# EAGLE design SSTuino_Evo (EAGLE 9.6.2)

## Sheet 1 of 2
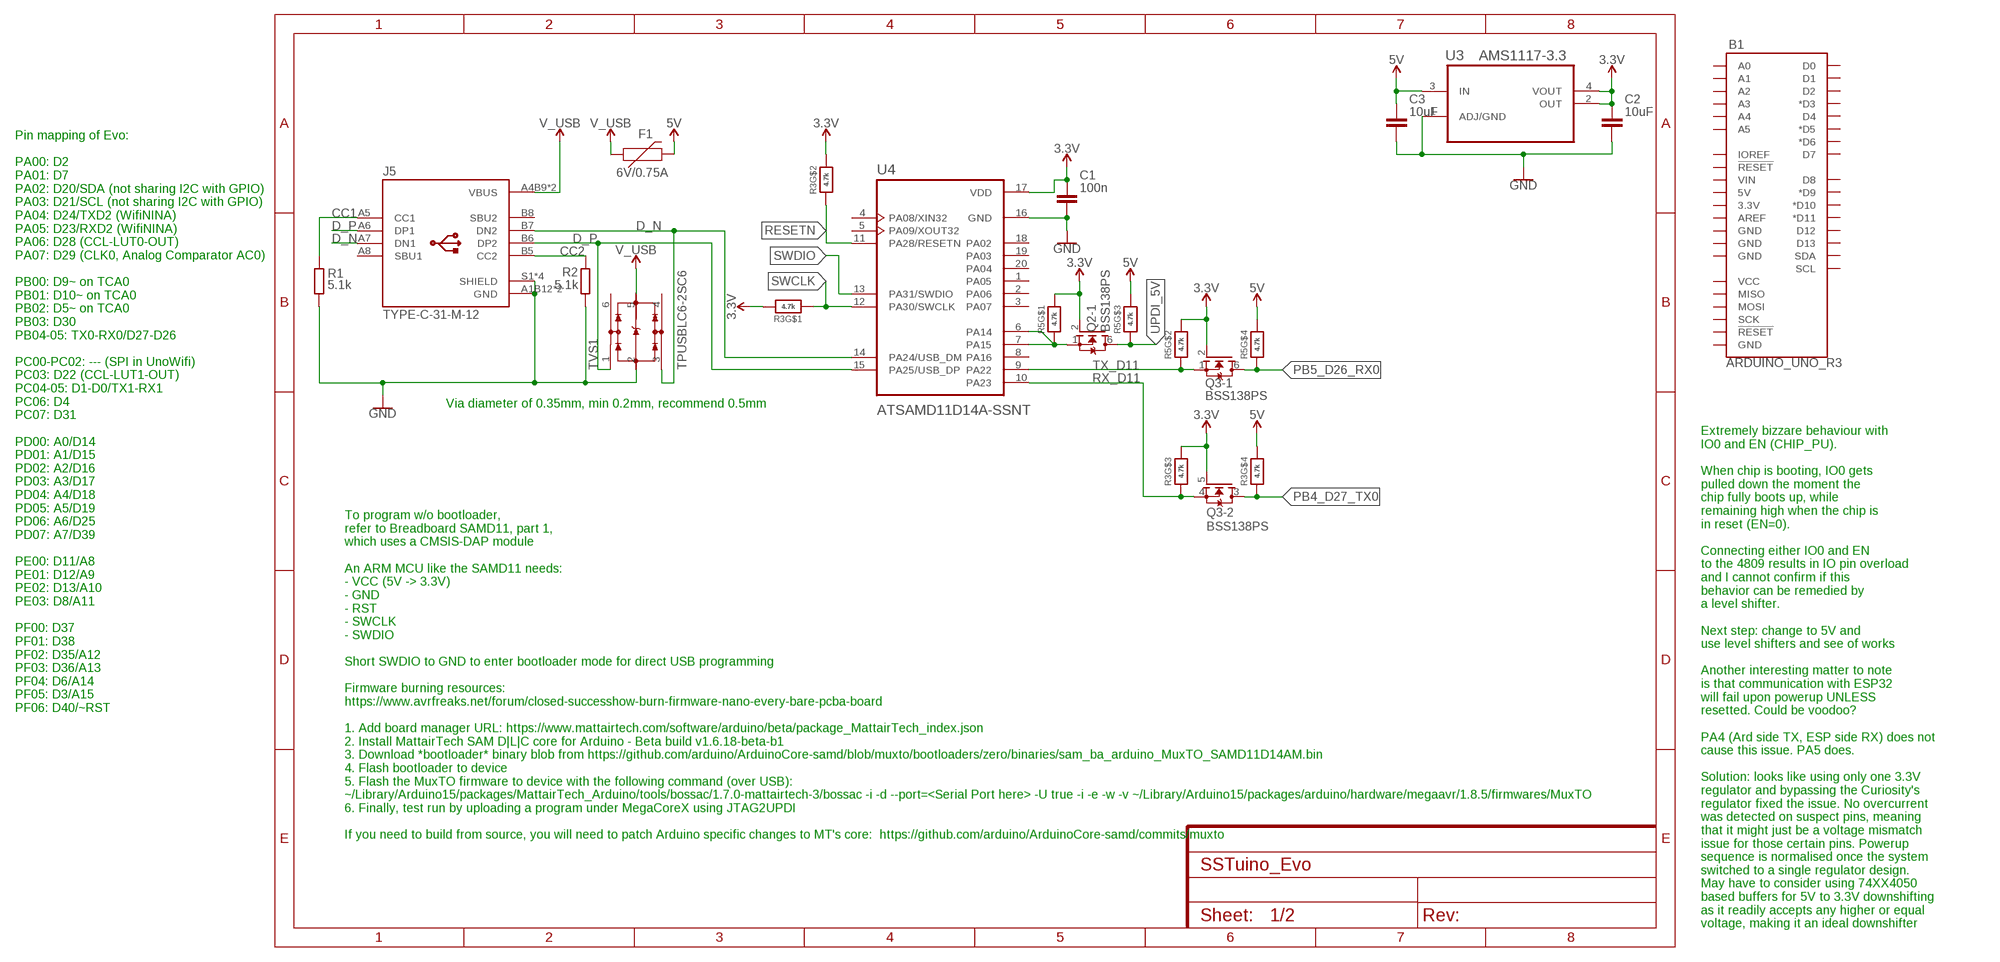
[diagram p0: schematic, sheet 1]

### Parts
B1  ARDUINO_UNO_R3  [ARDUINO_R3]
C1  100n  C_CHIP-0402(1005-METRIC)  [CAPC1005X60]
C2  10uF  C_CHIP-0603(1608-METRIC)  [CAPC1608X85]
C3  10uF  C_CHIP-0603(1608-METRIC)  [CAPC1608X85]
F1  6V/0.75A  PPTC_THREE-QUARTER-AMP  [1206]
J5  TYPE-C-31-M-12  [HRO_TYPE-C-31-M-12]
Q2  BSS138PS  [ARDUINO-TRANSISTORS_SOT363]
Q3  BSS138PS  [ARDUINO-TRANSISTORS_SOT363]
R1  5.1k  R_CHIP-0402(1005-METRIC)  [RESC1005X40]
R2  5.1k  R_CHIP-0402(1005-METRIC)  [RESC1005X40]
R3  4.7k  RESISTOR_4PACK0402  [RESPACK_4X0402]
R5  4.7k  RESISTOR_4PACK0402  [RESPACK_4X0402]
TVS1  TPUSBLC6-2SC6  [SOT95P280X110-6N]
U3  AMS1117-3.3  LM1117MP-3.3  [SOT230P696X180-4N]
U4  ATSAMD11D14A-SSNT  [SOIC127P1030X265-20N]

### Nets
3.3V: C1.1 C2.1 Q2.2(-1:G) Q3.2(-1:G) Q3.5(-2:G) R3.6 R3.7 R3.8 R5.7 R5.8 U3.2(OUT) U3.4(VOUT) U4.17(VDD) ; also sheet 2
5V: C3.1 F1.2 R3.5 R5.5 R5.6 U3.3(IN) ; also sheet 2
CC1: J5.A5(CC1) R1.1
CC2: J5.B5(CC2) R2.2
D_N [differential]: J5.A7(DN1) J5.B7(DN2) TVS1.3(IO2) U4.14(PA24/USB_DM)
D_P [differential]: J5.A6(DP1) J5.B6(DP2) TVS1.1(IO1) U4.15(PA25/USB_DP)
GND: C1.2 C2.2 C3.2 J5.A1B12(GND) J5.B1A12(GND) J5.S1(SHIELD) J5.S2(SHIELD) J5.S3(SHIELD) J5.S4(SHIELD) R1.2 R2.1 TVS1.2(VSS) U3.1(ADJ/GND) U4.16(GND) ; also sheet 2
PB4_D27_TX0: Q3.3(-2:D) R3.4 ; also sheet 2
PB5_D26_RX0: Q3.6(-1:D) R5.4 ; also sheet 2
RESETN: R3.2 U4.11(PA28/RESETN) ; also sheet 2
RX_D11: Q3.4(-2:S) R3.3 U4.10(PA23)
SWCLK: R3.1 U4.12(PA30/SWCLK) ; also sheet 2
SWDIO: U4.13(PA31/SWDIO) ; also sheet 2
TX_D11: Q3.1(-1:S) R5.2 U4.9(PA22)
UPDI_3V3: Q2.1(-1:S) R5.1 U4.6(PA14) U4.7(PA15)
UPDI_5V: Q2.6(-1:D) R5.3 ; also sheet 2
V_USB: F1.1 J5.A4B9(VBUS) J5.B4A9(VBUS) TVS1.5(VCC)
Unconnected: B1.3.3V B1.5V B1.A0 B1.A1 B1.A2 B1.A3 B1.A4 B1.A5 B1.AREF B1.D0 B1.D1 B1.D2 B1.D3(*D3) B1.D4 B1.D5(*D5) B1.D6(*D6) B1.D7 B1.D8 B1.D9(*D9) B1.D10(*D10) B1.D11(*D11) B1.D12 B1.D13 B1.GND@1(GND) B1.GND@2(GND) B1.GND@3(GND) B1.GND@4(GND) B1.IOREF B1.MISO B1.MOSI B1.RESET@1(!RESET!) B1.RESET@2(!RESET!) B1.SCK B1.SCL B1.SDA B1.VCC B1.VIN J5.A8(SBU1) J5.B8(SBU2) TVS1.4(IO3) TVS1.6(IO4) U4.1(PA05) U4.2(PA06) U4.3(PA07) U4.4(PA08/XIN32) U4.5(PA09/XOUT32) U4.8(PA16) U4.18(PA02) U4.19(PA03) U4.20(PA04)

### Notes on the sheet
- Via diameter of 0.35mm, min 0.2mm, recommend 0.5mm
- Pin mapping of Evo:
  
  PA00: D2
  PA01: D7
  PA02: D20/SDA (not sharing I2C with GPIO)
  PA03: D21/SCL (not sharing I2C with GPIO)
  PA04: D24/TXD2 (WifiNINA)
  PA05: D23/RXD2 (WifiNINA)
  PA06: D28 (CCL-LUT0-OUT)
  PA07: D29 (CLK0, Analog Comparator AC0)
  
  PB00: D9~ on TCA0
  PB01: D10~ on TCA0
  PB02: D5~ on TCA0
  PB03: D30
  PB04-05: TX0-RX0/D27-D26
  
  PC00-PC02: --- (SPI in UnoWifi)
  PC03: D22 (CCL-LUT1-OUT)
  PC04-05: D1-D0/TX1-RX1
  PC06: D4
  PC07: D31
  
  PD00: A0/D14
  PD01: A1/D15
  PD02: A2/D16
  PD03: A3/D17
  PD04: A4/D18
  PD05: A5/D19
  PD06: A6/D25
  PD07: A7/D39
  
  PE00: D11/A8
  PE01: D12/A9
  PE02: D13/A10
  PE03: D8/A11
  
  PF00: D37
  PF01: D38
  PF02: D35/A12
  PF03: D36/A13
  PF04: D6/A14
  PF05: D3/A15
  PF06: D40/~RST
- To program w/o bootloader,
  refer to Breadboard SAMD11, part 1,
  which uses a CMSIS-DAP module
  
  An ARM MCU like the SAMD11 needs:
  - VCC (5V -> 3.3V)
  - GND
  - RST
  - SWCLK
  - SWDIO
  
  Short SWDIO to GND to enter bootloader mode for direct USB programming
  
  Firmware burning resources:
  https://www.avrfreaks.net/forum/closed-successhow-burn-firmware-nano-every-bare-pcba-board
  
  1. Add board manager URL: https://www.mattairtech.com/software/arduino/beta/package_MattairTech_index.json
  2. Install MattairTech SAM D|L|C core for Arduino - Beta build v1.6.18-beta-b1
  3. Download *bootloader* binary blob from https://github.com/arduino/ArduinoCore-samd/blob/muxto/bootloaders/zero/binaries/sam_ba_arduino_MuxTO_SAMD11D14AM.bin
  4. Flash bootloader to device
  5. Flash the MuxTO firmware to device with the following command (over USB): 
  ~/Library/Arduino15/packages/MattairTech_Arduino/tools/bossac/1.7.0-mattairtech-3/bossac -i -d --port=<Serial Port here> -U true -i -e -w -v ~/Library/Arduino15/packages/arduino/hardware/megaavr/1.8.5/firmwares/MuxTO
  6. Finally, test run by uploading a program under MegaCoreX using JTAG2UPDI
  
  If you need to build from source, you will need to patch Arduino specific changes to MT's core:  https://github.com/arduino/ArduinoCore-samd/commits/muxto
- Extremely bizzare behaviour with
  IO0 and EN (CHIP_PU). 
  
  When chip is booting, IO0 gets 
  pulled down the moment the 
  chip fully boots up, while 
  remaining high when the chip is
  in reset (EN=0).
  
  Connecting either IO0 and EN
  to the 4809 results in IO pin overload
  and I cannot confirm if this
  behavior can be remedied by
  a level shifter. 
  
  Next step: change to 5V and
  use level shifters and see of works
  
  Another interesting matter to note
  is that communication with ESP32
  will fail upon powerup UNLESS
  resetted. Could be voodoo?
  
  PA4 (Ard side TX, ESP side RX) does not
  cause this issue. PA5 does.
  
  Solution: looks like using only one 3.3V 
  regulator and bypassing the Curiosity's
  regulator fixed the issue. No overcurrent
  was detected on suspect pins, meaning
  that it might just be a voltage mismatch
  issue for those certain pins. Powerup
  sequence is normalised once the system
  switched to a single regulator design.
  May have to consider using 74XX4050
  based buffers for 5V to 3.3V downshifting
  as it readily accepts any higher or equal
  voltage, making it an ideal downshifter

## Sheet 2 of 2
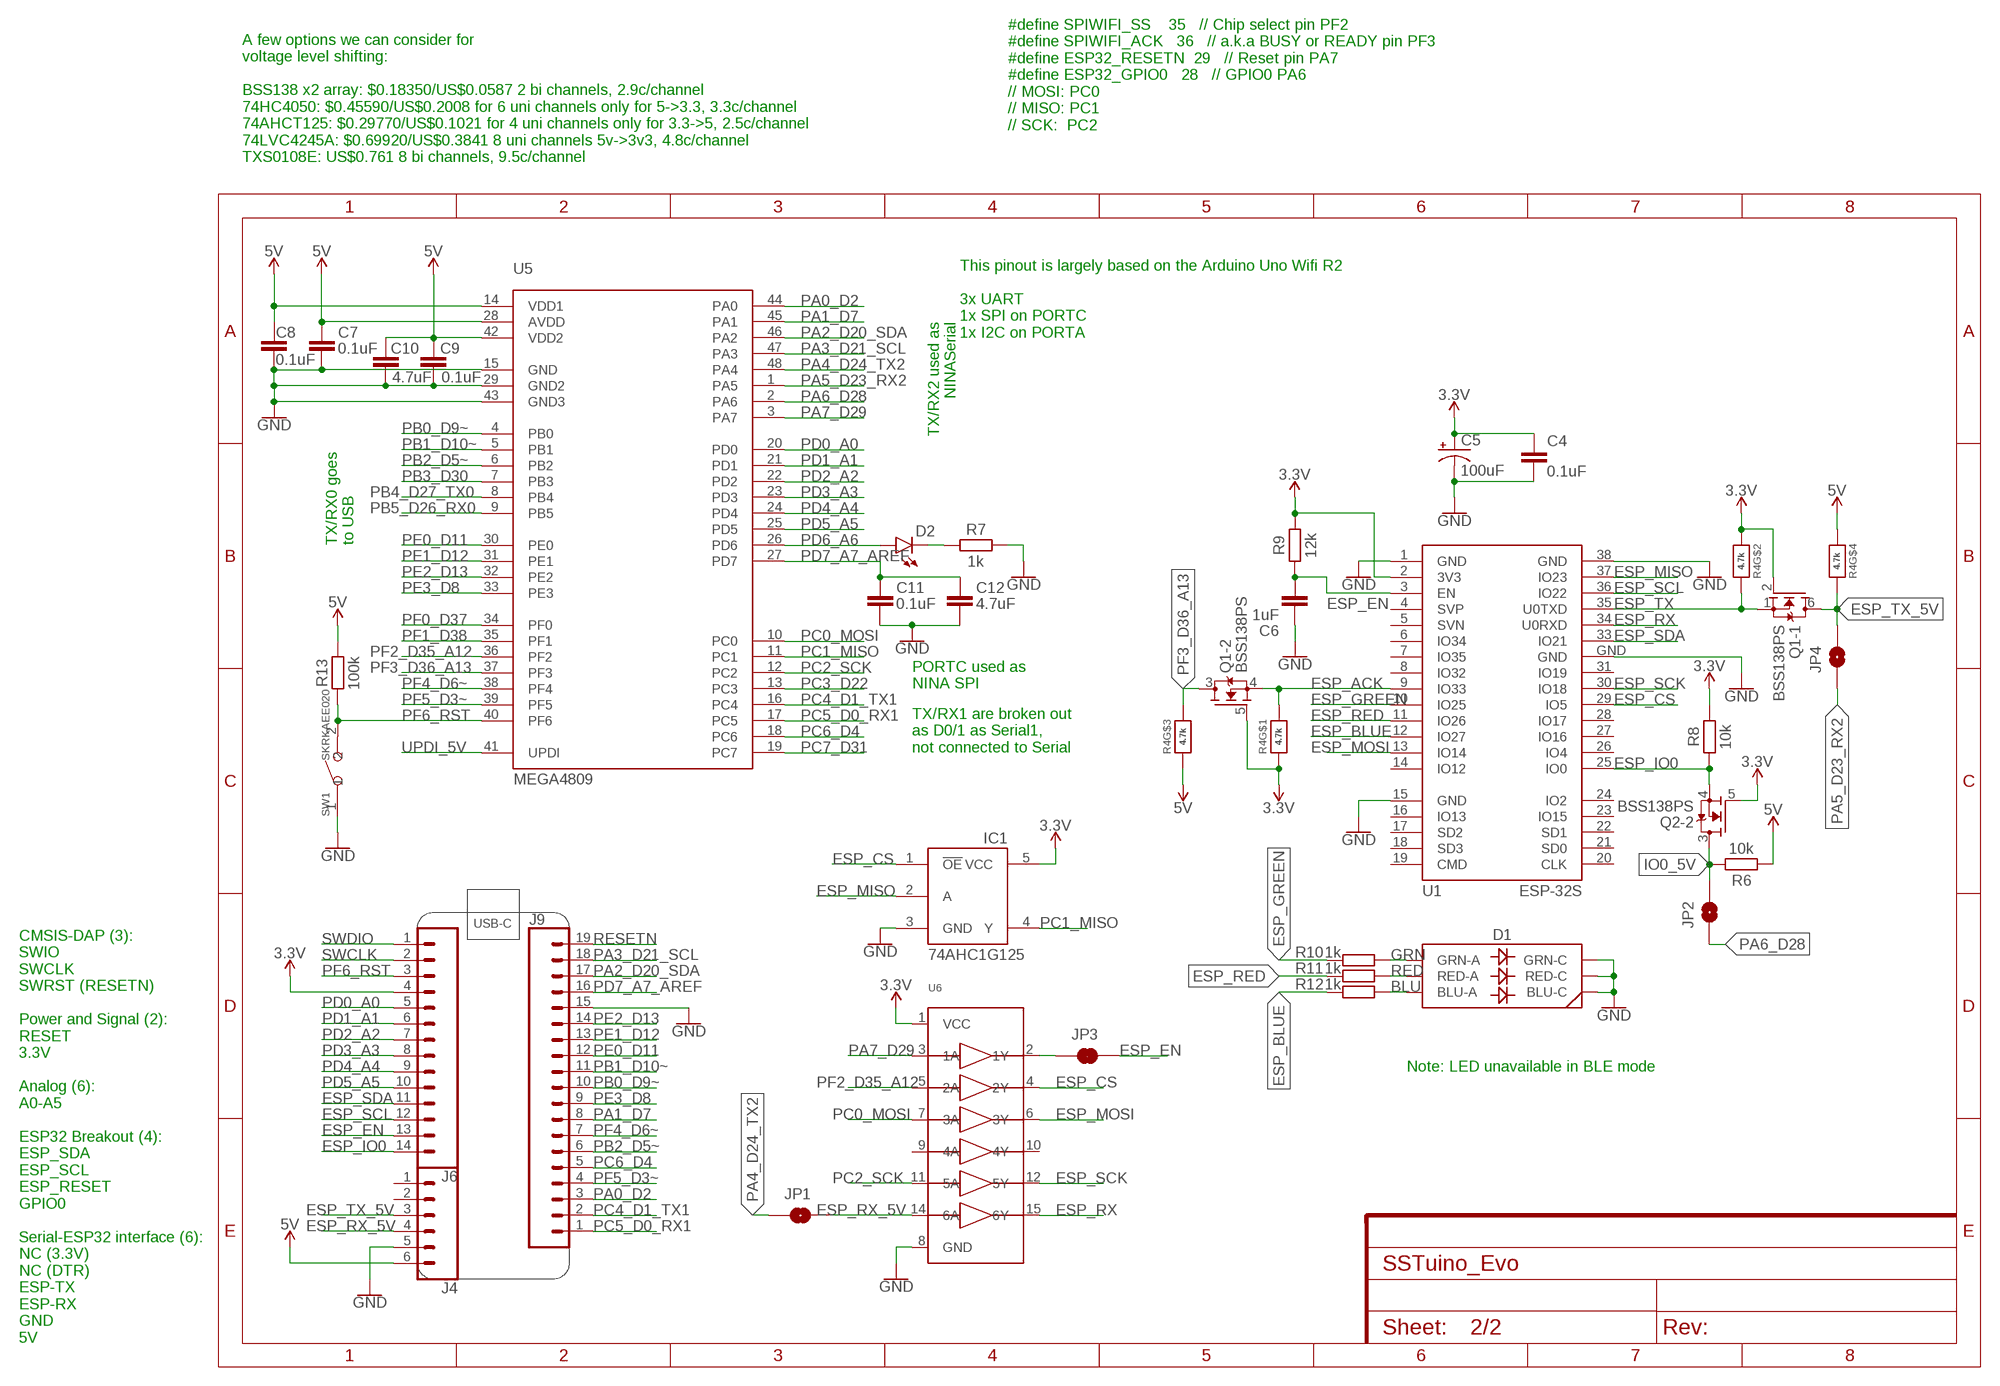
[diagram p1: schematic, sheet 2]

### Parts
C4  0.1uF  C_CHIP-0402(1005-METRIC)  [CAPC1005X60]
C5  100uF  C-POL-US_TANTALUM-1206(3216-METRIC)  [CAPMP3216X180N]
C6  1uF  C_CHIP-0402(1005-METRIC)  [CAPC1005X60]
C7  0.1uF  C_CHIP-0402(1005-METRIC)  [CAPC1005X60]
C8  0.1uF  C_CHIP-0402(1005-METRIC)  [CAPC1005X60]
C9  0.1uF  C_CHIP-0402(1005-METRIC)  [CAPC1005X60]
C10  4.7uF  C_CHIP-0402(1005-METRIC)  [CAPC1005X60]
C11  0.1uF  C_CHIP-0402(1005-METRIC)  [CAPC1005X60]
C12  4.7uF  C_CHIP-0402(1005-METRIC)  [CAPC1005X60]
D1  LED-RGBTC5050RGBF08  [LED-TRICOLOR-5050]
D2  LED0603  [LED-0603]
IC1  74AHC1G125  [SOT23-5L]
J4  CONN_06NO_SILK_FEMALE_PTH  [1X06_NO_SILK]
J6  CONN_14NO_SILK  [1X14_NO_SILK]
J9  CONN_191X19_NO_SILK  [1X19_NO_SILK]
JP1  JUMPER-SMT_2_NO_SILK  [SMT-JUMPER_2_NO_SILK]
JP2  JUMPER-SMT_2_NO_SILK  [SMT-JUMPER_2_NO_SILK]
JP3  JUMPER-SMT_2_NC_TRACE_SILK  [SMT-JUMPER_2_NC_TRACE_SILK]
JP4  JUMPER-SMT_2_NO_SILK  [SMT-JUMPER_2_NO_SILK]
Q1  BSS138PS  [ARDUINO-TRANSISTORS_SOT363]
R4  4.7k  RESISTOR_4PACK0402  [RESPACK_4X0402]
R6  10k  R_CHIP-0402(1005-METRIC)  [RESC1005X40]
R7  1k  R_CHIP-0402(1005-METRIC)  [RESC1005X40]
R8  10k  R_CHIP-0402(1005-METRIC)  [RESC1005X40]
R9  12k  R_CHIP-0402(1005-METRIC)  [RESC1005X40]
R10  1k  R_CHIP-0402(1005-METRIC)  [RESC1005X40]
R11  1k  R_CHIP-0402(1005-METRIC)  [RESC1005X40]
R12  1k  R_CHIP-0402(1005-METRIC)  [RESC1005X40]
R13  100k  R_CHIP-0402(1005-METRIC)  [RESC1005X40]
SW1  SKRKAEE020  SMD-BUTTON(2P-3.9X2.9X1.5+0.4MM)-SKRKAEE020  [SW2-2.6-3.9X2.9X1.5+0.4MM]
U1  ESP-32S  [ESP-32S]
U5  MEGA4809  [TQFP48]
U6  74HC4050DTSSOP  [TSSOP16]

### Nets
3.3V: C4.1 C5.1(+) IC1.5(VCC) J6.4 Q1.2(-1:G) Q1.5(-2:G) Q2.5(-2:G) R4.1 R4.2 R8.2 R9.2 U1.2(3V3) U6.1(VCC) ; also sheet 1
5V: C7.1 C8.1 C9.1 C10.1 J4.6 R4.3 R4.4 R6.1 R13.2 U5.14(VDD1) U5.28(AVDD) U5.42(VDD2) ; also sheet 1
BLU: D1.6(BLU-A) R12.2
ESP_ACK: Q1.4(-2:S) R4.8 U1.9(IO33)
ESP_BLUE: R12.1 U1.12(IO27)
ESP_CS: IC1.1(!OE) U1.29(IO5) U6.4(2Y)
ESP_EN: C6.2 J6.13 JP3.2 R9.1 U1.3(EN)
ESP_GREEN: R10.1 U1.10(IO25)
ESP_IO0: J6.14 Q2.4(-2:S) R8.1 U1.25(IO0)
ESP_MISO: IC1.2(A) U1.37(IO23)
ESP_MOSI: U1.13(IO14) U6.6(3Y)
ESP_RED: R11.1 U1.11(IO26)
ESP_RX: U1.34(U0RXD) U6.15(6Y)
ESP_RX_5V: J4.4 JP1.2 U6.14(6A)
ESP_SCK: U1.30(IO18) U6.12(5Y)
ESP_SCL: J6.12 U1.36(IO22)
ESP_SDA: J6.11 U1.33(IO21)
ESP_TX: Q1.1(-1:S) R4.7 U1.35(U0TXD)
ESP_TX_5V: J4.3 JP4.2 Q1.6(-1:D) R4.5
GND: C4.2 C5.2(-) C6.1 C7.2 C8.2 C9.2 C10.2 C11.2 C12.2 D1.1(BLU-C) D1.2(RED-C) D1.3(GRN-C) IC1.3(GND) J4.5 J9.15 R7.2 SW1.1 U1.1(GND) U1.15(GND) U1.38(GND) U1.GND U5.15(GND) U5.29(GND2) U5.43(GND3) U6.8(GND) ; also sheet 1
GRN: D1.4(GRN-A) R10.2
IO0_5V: JP2.2 Q2.3(-2:D) R6.2
N$2: D2.C R7.1
N$4: JP3.1 U6.2(1Y)
PA0_D2: J9.3 U5.44(PA0)
PA1_D7: J9.8 U5.45(PA1)
PA2_D20_SDA: J9.17 U5.46(PA2)
PA3_D21_SCL: J9.18 U5.47(PA3)
PA4_D24_TX2: JP1.1 U5.48(PA4)
PA5_D23_RX2: JP4.1 U5.1(PA5)
PA6_D28: JP2.1 U5.2(PA6)
PA7_D29: U5.3(PA7) U6.3(1A)
PB0_D9~: J9.10 U5.4(PB0)
PB1_D10~: J9.11 U5.5(PB1)
PB2_D5~: J9.6 U5.6(PB2)
PB3_D30: U5.7(PB3)
PB4_D27_TX0: U5.8(PB4) ; also sheet 1
PB5_D26_RX0: U5.9(PB5) ; also sheet 1
PC0_MOSI: U5.10(PC0) U6.7(3A)
PC1_MISO: IC1.4(Y) U5.11(PC1)
PC2_SCK: U5.12(PC2) U6.11(5A)
PC3_D22: U5.13(PC3)
PC4_D1_TX1: J9.2 U5.16(PC4)
PC5_D0_RX1: J9.1 U5.17(PC5)
PC6_D4: J9.5 U5.18(PC6)
PC7_D31: U5.19(PC7)
PD0_A0: J6.5 U5.20(PD0)
PD1_A1: J6.6 U5.21(PD1)
PD2_A2: J6.7 U5.22(PD2)
PD3_A3: J6.8 U5.23(PD3)
PD4_A4: J6.9 U5.24(PD4)
PD5_A5: J6.10 U5.25(PD5)
PD6_A6: D2.A U5.26(PD6)
PD7_A7_AREF: C11.1 C12.1 J9.16 U5.27(PD7)
PE0_D11: J9.12 U5.30(PE0)
PE1_D12: J9.13 U5.31(PE1)
PE2_D13: J9.14 U5.32(PE2)
PE3_D8: J9.9 U5.33(PE3)
PF0_D37: U5.34(PF0)
PF1_D38: U5.35(PF1)
PF2_D35_A12: U5.36(PF2) U6.5(2A)
PF3_D36_A13: Q1.3(-2:D) R4.6 U5.37(PF3)
PF4_D6~: J9.7 U5.38(PF4)
PF5_D3~: J9.4 U5.39(PF5)
PF6_RST: J6.3 R13.1 SW1.2 U5.40(PF6)
RED: D1.5(RED-A) R11.2
RESETN: J9.19 ; also sheet 1
SWCLK: J6.2 ; also sheet 1
SWDIO: J6.1 ; also sheet 1
UPDI_5V: U5.41(UPDI) ; also sheet 1
Unconnected: J4.1 J4.2 U1.4(SVP) U1.5(SVN) U1.6(IO34) U1.7(IO35) U1.8(IO32) U1.14(IO12) U1.16(IO13) U1.17(SD2) U1.18(SD3) U1.19(CMD) U1.20(CLK) U1.21(SD0) U1.22(SD1) U1.23(IO15) U1.24(IO2) U1.26(IO4) U1.27(IO16) U1.28(IO17) U1.31(IO19) U6.9(4A) U6.10(4Y)

### Notes on the sheet
- #define SPIWIFI_SS    35   // Chip select pin PF2
  #define SPIWIFI_ACK   36   // a.k.a BUSY or READY pin PF3
  #define ESP32_RESETN  29   // Reset pin PA7
  #define ESP32_GPIO0   28   // GPIO0 PA6
  // MOSI: PC0
  // MISO: PC1
  // SCK:  PC2
- A few options we can consider for
  voltage level shifting:
  
  BSS138 x2 array: $0.18350/US$0.0587 2 bi channels, 2.9c/channel
  74HC4050: $0.45590/US$0.2008 for 6 uni channels only for 5->3.3, 3.3c/channel
  74AHCT125: $0.29770/US$0.1021 for 4 uni channels only for 3.3->5, 2.5c/channel
  74LVC4245A: $0.69920/US$0.3841 8 uni channels 5v->3v3, 4.8c/channel
  TXS0108E: US$0.761 8 bi channels, 9.5c/channel
- TX/RX2 used as
  NINASerial
- This pinout is largely based on the Arduino Uno Wifi R2
  
  3x UART
  1x SPI on PORTC
  1x I2C on PORTA
- TX/RX0 goes
  to USB
- PORTC used as
  NINA SPI
- TX/RX1 are broken out 
  as D0/1 as Serial1,
  not connected to Serial
- USB-C
- Note: LED unavailable in BLE mode
- CMSIS-DAP (3):
  SWIO
  SWCLK
  SWRST (RESETN)
  
  Power and Signal (2):
  RESET
  3.3V
  
  Analog (6):
  A0-A5
  
  ESP32 Breakout (4):
  ESP_SDA
  ESP_SCL
  ESP_RESET
  GPIO0
  
  Serial-ESP32 interface (6):
  NC (3.3V)
  NC (DTR)
  ESP-TX
  ESP-RX
  GND
  5V

## Library data of the parts
B1 = SparkFun-Boards:ARDUINO_UNO_R3: Arduino R3 Footprint with SPI header Arduino Uno R3 Compatible Footprint. Matches PCB size of the original board. SparkFun Products: SAMD21 Dev Breakout <https://www.sparkfun.com/products/13672> RedBoard <https://www.sparkfun.com/products/12757> R3 Stackable Headers <https://www.sparkfun.com/products/11417>
C1-C4 C6-C12 = Capacitor:C: Capacitor - Generic; CATEGORY: Capacitor
C5 = Capacitor:C-POL-US: Capacitor Polarised - ANSI; CATEGORY: Capacitor
D1 = D3ltav's Custom:LED-RGB: LED-RGB 6 pin RGB LED (no common connector) Warning: please check and double check your pinout vs. the datasheet! 5050 SMD LEDs are commonly packaged in all sorts of weird, non-standard pinouts. This footprint and symbol is only applicable to the LED mentioned below Packages: LED-TRICOLOR-5050 - Based on TC5050RGBF08 RGB LED <https://datasheet.lcsc.com/szlcsc/2009231707_TCWIN-TC5050RGBF08-3CJH-AF53A_C784540.pdf>; PROD_ID: DIO-10298
D2 = SparkFun-LED:LED: LED (Generic) Standard schematic elements and footprints for 5mm, 3mm, 1206, and 0603 sized LEDs. Generic LEDs with no color specified.
F1 = SparkFun-Fuses:PPTC: Resettable Fuse PPTC Resettable Fuse. Really a sort of resistor with a polymeric positive temperature coefficient whose resistance increases dramatically with an increase in temperature. When heated by the power passing through the resistance rises causing the current to be limited, protecting the circuit. This is achieved by the transition of the polymer from a crystalline to an amorphous state where the conductive carbon separates breaking the conductive pathways found in the cool crystalline structure. When a PPTC cools back down it resumes conducting letting the circuit turn back on. SparkFun Products: SparkFun RedBoard - Programmed with Arduino <https://www.sparkfun.com/products/12757> Pro Micro - 5V/16MHz <https://www.sparkfun.com/products/12640> Arduino Pro 328 - 5V/16MHz <https://www.sparkfun.com/products/10915> MP3 Trigger <https://www.sparkfun.com/products/13720>; LCSC_PART: C99563; PROD_ID: RES-11150
IC1 = adafruit:74AHC1G125; LCSC_PART: C124295
J4 = SparkFun-Connectors:CONN_06: Multi connection point. Often used as Generic Header-pin footprint for 0.1 inch spaced/style header connections On any of the 0.1 inch spaced packages, you can populate with these: Break Away Headers - Straight <https://www.sparkfun.com/products/116> (PRT-00116) Break Away Male Headers - Right Angle <https://www.sparkfun.com/products/553> (PRT-00553) Female Headers <https://www.sparkfun.com/products/115> (PRT-00115) Break Away Headers - Machine Pin <https://www.sparkfun.com/products/117> (PRT-00117) Break Away Female Headers - Swiss Machine Pin <https://www.sparkfun.com/products/743> (PRT-00743) Arduino Stackable Header - 6 Pin <https://www.sparkfun.com/products/9280> (PRT-09280) For SCREWTERMINALS and SPRING TERMINALS visit here: Screw Terimnals on SparkFun.com <https://www.sparkfun.com/search/results?term=Screw+Terminals> (5mm/3.5mm/2.54mm spacing) This device is also useful as a general connection point to wire up your design to another part of your project. Our various solder wires solder well into these plated through hole pads. Hook-Up Wire - Assortment (Stranded, 22 AWG) <https://www.sparkfun.com/products/11375> (PRT-11375) Hook-Up Wire - Assortment (Solid Core, 22 AWG) <https://www.sparkfun.com/products/11367> (PRT-11367) View the entire wire category on our website here <https://www.sparkfun.com/categories/141>; PROD_ID: CONN-08437
J5 = D3ltav's Custom:TYPE-C-31-M-12: USB Connectors 24 Receptacle 1 8.94*7.3mm RoHS Check prices <https://pricing.snapeda.com/parts/TYPE-C-31-M-12/HRO%20Electronics%20Co.%2C%20Ltd./view-part?ref=eda>; AVAILABILITY: No availability data; DESCRIPTION: USB Connectors 24 Receptacle 1 8.94*7.3mm RoHS; LCSC_PART: C165948; MF: HRO Electronics Co., Ltd.; MP: TYPE-C-31-M-12; PACKAGE: Package; PRICE: None
J6 = SparkFun-Connectors:CONN_14: Multi connection point. Often used as Generic Header-pin footprint for 0.1 inch spaced/style header connections On any of the 0.1 inch spaced packages, you can populate with these: Break Away Headers - Straight <https://www.sparkfun.com/products/116> (PRT-00116) Break Away Male Headers - Right Angle <https://www.sparkfun.com/products/553> (PRT-00553) Female Headers <https://www.sparkfun.com/products/115> (PRT-00115) Break Away Headers - Machine Pin <https://www.sparkfun.com/products/117> (PRT-00117) Break Away Female Headers - Swiss Machine Pin <https://www.sparkfun.com/products/743> (PRT-00743) For SCREWTERMINALS and SPRING TERMINALS visit here: Screw Terimnals on SparkFun.com <https://www.sparkfun.com/search/results?term=Screw+Terminals> (5mm/3.5mm/2.54mm spacing) This device is also useful as a general connection point to wire up your design to another part of your project. Our various solder wires solder well into these plated through hole pads. Hook-Up Wire - Assortment (Stranded, 22 AWG) <https://www.sparkfun.com/products/11375> (PRT-11375) Hook-Up Wire - Assortment (Solid Core, 22 AWG) <https://www.sparkfun.com/products/11367> (PRT-11367) View the entire wire category on our website here <https://www.sparkfun.com/categories/141> Special notes: Molex polarized connector foot print use with SKU : PRT-08231 with associated crimp pins and housings. 1MM SMD Version SKU: PRT-10208 NOTES ON THE VARIANTS LOCK and LOCK_LONGPADS... This footprint was designed to help hold the alignment of a through-hole component (i.e. 6-pin header) while soldering it into place. You may notice that each hole has been shifted either up or down by 0.005 of an inch from it's more standard position (which is a perfectly straight line). This slight alteration caused the pins (the squares in the middle) to touch the edges of the holes. Because they are alternating, it causes a "brace" to hold the component in place. 0.005 has proven to be the perfect amount of "off-center" position when using our standard breakaway headers. Although looks a little odd when you look at the bare footprint, once you have a header in there, the alteration is very hard to notice. Also,if you push a header all the way into place, it is covered up entirely on the bottom side.
J9 = SparkFun-Connectors:CONN_19: Multi connection point. Often used as Generic Header-pin footprint for 0.1 inch spaced/style header connections On any of the 0.1 inch spaced packages, you can populate with these: Break Away Headers - Straight <https://www.sparkfun.com/products/116> (PRT-00116) Break Away Male Headers - Right Angle <https://www.sparkfun.com/products/553> (PRT-00553) Female Headers <https://www.sparkfun.com/products/115> (PRT-00115) Break Away Headers - Machine Pin <https://www.sparkfun.com/products/117> (PRT-00117) Break Away Female Headers - Swiss Machine Pin <https://www.sparkfun.com/products/743> (PRT-00743) For SCREWTERMINALS and SPRING TERMINALS visit here: Screw Terimnals on SparkFun.com <https://www.sparkfun.com/search/results?term=Screw+Terminals> (5mm/3.5mm/2.54mm spacing) This device is also useful as a general connection point to wire up your design to another part of your project. Our various solder wires solder well into these plated through hole pads. Hook-Up Wire - Assortment (Stranded, 22 AWG) <https://www.sparkfun.com/products/11375> (PRT-11375) Hook-Up Wire - Assortment (Solid Core, 22 AWG) <https://www.sparkfun.com/products/11367> (PRT-11367) View the entire wire category on our website here <https://www.sparkfun.com/categories/141> Special notes: Molex polarized connector foot print use with SKU : PRT-08231 with associated crimp pins and housings. 1MM SMD Version SKU: PRT-10208 NOTES ON THE VARIANTS LOCK and LOCK_LONGPADS... This footprint was designed to help hold the alignment of a through-hole component (i.e. 6-pin header) while soldering it into place. You may notice that each hole has been shifted either up or down by 0.005 of an inch from it's more standard position (which is a perfectly straight line). This slight alteration caused the pins (the squares in the middle) to touch the edges of the holes. Because they are alternating, it causes a "brace" to hold the component in place. 0.005 has proven to be the perfect amount of "off-center" position when using our standard breakaway headers. Although looks a little odd when you look at the bare footprint, once you have a header in there, the alteration is very hard to notice. Also,if you push a header all the way into place, it is covered up entirely on the bottom side.
JP1 JP2 JP4 = SparkFun-Jumpers:JUMPER-SMT_2_NO: Normally open jumper This jumper has two pads in close proximity to each other. Apply solder to close the connection. Round pads are easier to solder for beginners, but are a lot larger. SparkFun Product that uses the round pads: SparkFun EL Sequencer <https://www.sparkfun.com/products/12781>
JP3 = SparkFun-Jumpers:JUMPER-SMT_2_NC_TRACE: Normally closed trace jumper This jumper has a trace between two pads so it's normally closed (NC). Use a razor knife to open the connection. For best results follow the IPC guidelines for cutting traces: Cutout at least 0.063 mm (0.005 in). Remove all loose material to clean up the cut area. Seal the cut with an approved epoxy. Reapply solder to reclose the connection.
Q1-Q3 = D3ltav's Custom:BSS138PS: MOSFET 2N-CH 60V 0.32A 6TSSOP; CODE-ARDUINO: 2323; DATASHEET: https://assets.nexperia.com/documents/data-sheet/BSS138PS.pdf; DISTRIBUTOR-LINK: http://www.digikey.com/product-detail/en/nxp-semiconductors/BSS138PS,115/568-8393-1-ND/2763927; DISTRIBUTOR-PN: 568-8393-1-ND; LCSC_PART: C193381; MANUFACTURER: NXP; MANUFACTURER-PN: BSS138PS,115
R1 R2 R6-R13 = Resistor:R: Resistor Fixed - Generic; CATEGORY: Resistor; SUB-CATEGORY: Fixed
R3-R5 = D3ltav's Custom:RESISTOR_4PACK: Resistor Packs (4 resistors) 4 x 0603 10K 1/16W - Digikey: YC164J-10KCT-ND; LCSC_PART: C1980
SW1 = D3ltav's Custom:SMD-BUTTON(2P-3.9X2.9X1.5+0.4MM): 311020047; LCSC_PART: C115357; MPN: SKRKAEE020
TVS1 = D3ltav's Custom:TPUSBLC6-2SC6: TPUSBLC6-2SC6 Low Capacitance 2-Line ESD Protection www.sot23.com.tw; LCSC_PART: C558442
U1 = esp32:ESP-32S: Ai-Thinker ESP-32S
U3 = D3ltav's Custom:LM1117MP-3.3: Linear regulators; LCSC_PART: C6186; MPN: LM1117MP-3.3; OC_FARNELL: 9778195; OC_NEWARK: 41K3470; PACKAGE: SOT223-3; SUPPLIER: NationalSemiconductor
U4 = D3ltav's Custom:ATSAMD11D14A-SSNT; AVAILABILITY: In Stock; DESCRIPTION: ARM® Cortex®-M0+ SAM D11D Microcontroller IC 32-Bit 48MHz 16KB (16K x 8) FLASH 20-SOIC; LCSC_PART: C2053599; MF: Microchip; MP: ATSAMD11D14A-SSNT; PACKAGE: SOIC-20 Microchip; PRICE: None
U5 = microwavemont_ATMEGA4809:MEGA4809; LCSC_PART: C189475
U6 = D3ltav's Custom:74HC4050D: 6-channel level shifter 74HC4050D - 2V-6V Supply SOIC16 Digikey: 74HC4050D,653-ND Mouser: 771-74HC4050D-T TSSOP16 Digikey: 296-9215-1-ND Mouser:; LCSC_PART: C43181

## Net classes
0 default: width 0.203 mm, drill 0.35 mm
1 differential: width 0.254 mm

## Board
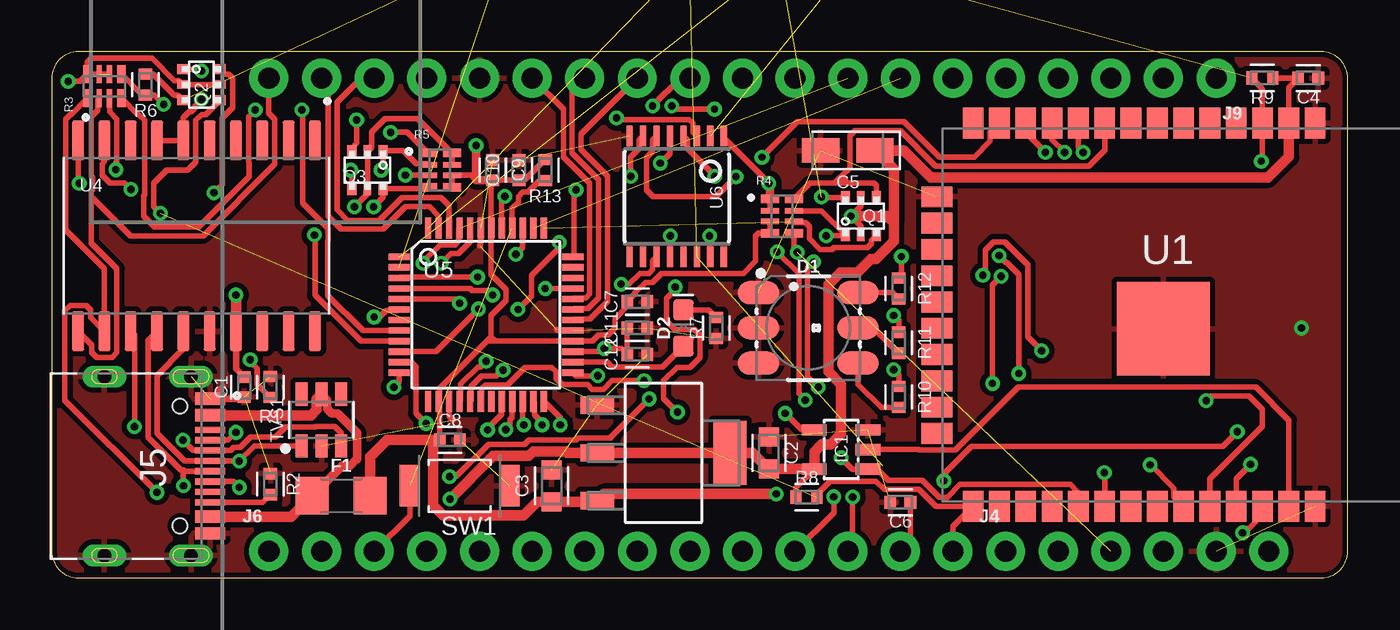
[diagram p2: board, top side]
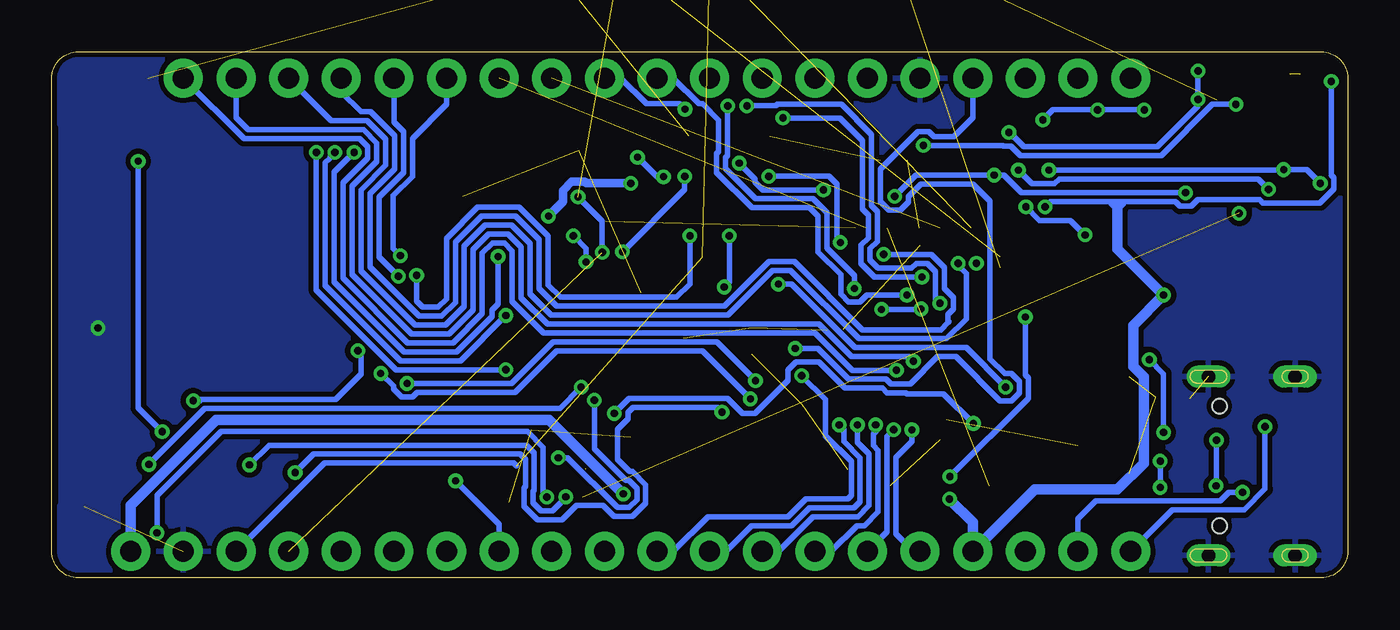
[diagram p3: board, bottom side, seen from below]

Size 62.55 x 25.4 mm. Coordinates in mm from the lower left corner, seen from the top.
Outline: 0,24.13 0,1.27 arc90 1.27,0 61.28,0 arc90 62.55,1.27 62.55,24.13 arc90 61.28,25.4 1.27,25.4 arc90 0,24.13
Copper layers (1*16): Top 0.035mm / dielectric 1.5mm / Bottom 0.035mm
Design rules "SparkFun-2-Layer-General-JLCPCB": minimum track width 7mil, minimum drill 0.3mm, track to track 7mil, track to pad 7mil, pad to pad 7mil, via to via 7mil, smd to smd 7mil, copper to edge 7mil, drill to drill 7mil, minimum pad ring 7mil, minimum via ring 7mil, stop-mask expansion 3mil, vias tented up to drill 25mil, thermal gap 10mil

### Footprints (pad centres in the part's own frame; a part is rotated, then mirrored left to right if it is on the bottom)
ARDUINO_R3 = drill 1.016 pad 1.93: 3.3V 2.54,-24.13; 5V 5.08,-24.13; A0 17.78,-24.13; A1 20.32,-24.13; A2 22.86,-24.13; A3 25.4,-24.13; A4 27.94,-24.13; A5 30.48,-24.13; AREF -9.144,24.13; D0 30.48,24.13; D1 27.94,24.13; D2 25.4,24.13; D3 22.86,24.13; D4 20.32,24.13; D5 17.78,24.13; D6 15.24,24.13; D7 12.7,24.13; D8 8.636,24.13; D9 6.096,24.13; D10 3.556,24.13; D11 1.016,24.13; D12 -1.524,24.13; D13 -4.064,24.13; GND@1 7.62,-24.13; GND@2 10.16,-24.13; GND@3 -6.604,24.13; GND@4 33.16,-1.32; IOREF -2.54,-24.13; MISO 30.62,3.76; MOSI 33.16,1.22; NC -5.08,-24.13; RESET@1 0,-24.13; RESET@2 30.62,-1.32; SCK 30.62,1.22; SCL -14.224,24.13; SDA -11.684,24.13; VCC 33.16,3.76; VIN 12.7,-24.13 | hole 3.175: -17.78,24.13; 33.02,8.89; 33.02,-19.05; -19.05,-24.13
CAPC1005X60 = smd 0.56 x 0.629: 1 -0.485,0; 2 0.485,0
CAPC1608X85 = smd 0.921 x 0.97: 1 -0.775,0; 2 0.775,0
CAPMP3216X180N = smd 1.796 x 1.189: 1 -1.31,0; 2 1.31,0
LED-TRICOLOR-5050 = smd 2 x 1.1: 1 2.4,-1.7; 2 2.4,0; 3 2.4,1.7; 4 -2.4,1.7; 5 -2.4,0; 6 -2.4,-1.7
LED-0603 = smd 1 x 1: A -0.877,0; C 0.877,0
1206 = smd 1.6 x 1.8: 1 -1.4,0; 2 1.4,0
SOT23-5L = smd 0.55 x 1.2: 1 -0.95,-1.3; 2 0,-1.3; 3 0.95,-1.3; 4 0.95,1.3; 5 -0.95,1.3
1X06_NO_SILK = drill 1.016 pad 1.88: 1 0,0; 2 2.54,0; 3 5.08,0; 4 7.62,0; 5 10.16,0; 6 12.7,0
HRO_TYPE-C-31-M-12 = smd 0.6 x 1.45: A1B12 -3.25,5.095; A4B9 -2.45,5.095; B1A12 3.25,5.095; B4A9 2.45,5.095 | smd 0.3 x 1.45: A5 -1.25,5.095; A6 -0.25,5.095; A7 0.25,5.095; A8 1.25,5.095; B5 1.75,5.095; B6 0.75,5.095; B7 -0.75,5.095; B8 -1.75,5.095 | drill 0.65 pad 1.05 long: S1 -4.32,4.18; S2 4.32,4.18; S3 -4.32,0; S4 4.32,0 | hole 0.7: -2.89,3.65; 2.89,3.65
1X14_NO_SILK = drill 1.016 pad 1.88: 1 0,0; 2 2.54,0; 3 5.08,0; 4 7.62,0; 5 10.16,0; 6 12.7,0; 7 15.24,0; 8 17.78,0; 9 20.32,0; 10 22.86,0; 11 25.4,0; 12 27.94,0; 13 30.48,0; 14 33.02,0
1X19_NO_SILK = drill 1.016 pad 1.88: 1 0,0; 2 2.54,0; 3 5.08,0; 4 7.62,0; 5 10.16,0; 6 12.7,0; 7 15.24,0; 8 17.78,0; 9 20.32,0; 10 22.86,0; 11 25.4,0; 12 27.94,0; 13 30.48,0; 14 33.02,0; 15 35.56,0; 16 38.1,0; 17 40.64,0; 18 43.18,0; 19 45.72,0
SMT-JUMPER_2_NO_SILK = smd 0.635 x 1.27: 1 -0.406,0; 2 0.406,0
SMT-JUMPER_2_NC_TRACE_SILK = smd 0.635 x 1.27: 1 -0.508,0; 2 0.508,0
ARDUINO-TRANSISTORS_SOT363 = smd 0.5 x 0.6: 1 -0.75,-0.9; 3 0.75,-0.9; 4 0.75,0.9; 6 -0.75,0.9 | smd 0.4 x 0.6: 2 0,-0.9; 5 0,0.9
RESC1005X40 = smd 0.535 x 0.644: 1 -0.507,0; 2 0.507,0
RESPACK_4X0402 = smd 0.87 x 0.41: 1 -0.58,0.825; 4 -0.58,-0.825; 5 0.58,-0.825; 8 0.58,0.825 | smd 0.87 x 0.26: 2 -0.58,0.25; 3 -0.58,-0.25; 6 0.58,-0.25; 7 0.58,0.25
SW2-2.6-3.9X2.9X1.5+0.4MM = smd 1 x 2: 1 -2.4,0; 2 2.4,0
SOT95P280X110-6N = smd 1.119 x 0.584: 1 -1.246,0.95; 2 -1.246,0; 3 -1.246,-0.95; 4 1.246,-0.95; 5 1.246,0; 6 1.246,0.95
ESP-32S = smd 1.5 x 1: 1 -9.25,7; 2 -9.25,5.73; 3 -9.25,4.46; 4 -9.25,3.19; 5 -9.25,1.92; 6 -9.25,0.65; 7 -9.25,-0.62; 8 -9.25,-1.89; 9 -9.25,-3.16; 10 -9.25,-4.43; 11 -9.25,-5.7; 12 -9.25,-6.97; 13 -9.25,-8.24; 14 -9.25,-9.51; 25 9.25,-9.51; 26 9.25,-8.24; 27 9.25,-6.97; 28 9.25,-5.7; 29 9.25,-4.43; 30 9.25,-3.16; 31 9.25,-1.89; 32 9.25,-0.62; 33 9.25,0.65; 34 9.25,1.92; 35 9.25,3.19; 36 9.25,4.46; 37 9.25,5.73; 38 9.25,7 | smd 1 x 1.5: 15 -5.7,-11.25; 16 -4.43,-11.25; 17 -3.16,-11.25; 18 -1.89,-11.25; 19 -0.62,-11.25; 20 0.65,-11.25; 21 1.92,-11.25; 22 3.19,-11.25; 23 4.46,-11.25; 24 5.73,-11.25 | smd 4.5 x 4.5: GND 0.68,-0.33
SOT230P696X180-4N = smd 1.6 x 0.838: 1 -3.2,2.311; 2 -3.2,0; 3 -3.2,-2.311 | smd 1.6 x 3.099: 4 3.2,0
SOIC127P1030X265-20N = smd 1.9 x 0.6: 1 -4.605,5.715; 2 -4.605,4.445; 3 -4.605,3.175; 4 -4.605,1.905; 5 -4.605,0.635; 6 -4.605,-0.635; 7 -4.605,-1.905; 8 -4.605,-3.175; 9 -4.605,-4.445; 10 -4.605,-5.715; 11 4.605,-5.715; 12 4.605,-4.445; 13 4.605,-3.175; 14 4.605,-1.905; 15 4.605,-0.635; 16 4.605,0.635; 17 4.605,1.905; 18 4.605,3.175; 19 4.605,4.445; 20 4.605,5.715
TQFP48 = smd 1.016 x 0.305: 1 -4.191,2.794; 2 -4.191,2.286; 3 -4.191,1.778; 4 -4.191,1.27; 5 -4.191,0.762; 6 -4.191,0.254; 7 -4.191,-0.254; 8 -4.191,-0.762; 9 -4.191,-1.27; 10 -4.191,-1.778; 11 -4.191,-2.286; 12 -4.191,-2.794; 25 4.191,-2.794; 26 4.191,-2.286; 27 4.191,-1.778; 28 4.191,-1.27; 29 4.191,-0.762; 30 4.191,-0.254; 31 4.191,0.254; 32 4.191,0.762; 33 4.191,1.27; 34 4.191,1.778; 35 4.191,2.286; 36 4.191,2.794 | smd 0.305 x 1.016: 13 -2.794,-4.191; 14 -2.286,-4.191; 15 -1.778,-4.191; 16 -1.27,-4.191; 17 -0.762,-4.191; 18 -0.254,-4.191; 19 0.254,-4.191; 20 0.762,-4.191; 21 1.27,-4.191; 22 1.778,-4.191; 23 2.286,-4.191; 24 2.794,-4.191; 37 2.794,4.191; 38 2.286,4.191; 39 1.778,4.191; 40 1.27,4.191; 41 0.762,4.191; 42 0.254,4.191; 43 -0.254,4.191; 44 -0.762,4.191; 45 -1.27,4.191; 46 -1.778,4.191; 47 -2.286,4.191; 48 -2.794,4.191
TSSOP16 = smd 0.305 x 0.991: 1 -2.275,-2.918; 2 -1.625,-2.918; 3 -0.975,-2.918; 4 -0.325,-2.918; 5 0.325,-2.918; 6 0.975,-2.918; 7 1.625,-2.918; 8 2.275,-2.918; 9 2.275,2.918; 10 1.625,2.918; 11 0.975,2.918; 12 0.325,2.918; 13 -0.325,2.918; 14 -0.975,2.918; 15 -1.625,2.918; 16 -2.275,2.918

### Placement (x,y rotation side)
B1  41.27,11.43 0 top
C1  9.29,9.21 270 top
C2  34.61,6.03 90 top
C3  24.13,4.45 90 top
C4  60.64,24.13 0 top
C5  38.42,20.64 180 top
C6  40.96,3.65 0 top
C7  28.26,13.34 0 top
C8  19.21,6.67 0 top
C9  21.27,19.68 90 top
C10  22.54,19.68 90 top
C11  28.26,12.06 0 top
C12  28.26,10.79 0 top
D1  36.51,12.06 180 top
D2  30.48,12.06 90 top
F1  13.97,3.97 0 top
IC1  38.1,6.19 90 top
J4  46.04,1.27 0 top
J5  2.54,5.4 270 top
J6  10.48,1.27 0 top
J9  56.2,24.13 180 top
JP1  30.8,29.53 270 bottom  (outside the outline)
JP2  21.59,29.84 90 bottom  (outside the outline)
JP3  39.05,29.84 270 bottom  (outside the outline)
JP4  35.24,29.53 270 bottom  (outside the outline)
Q1  39.05,17.46 0 top
Q2  7.22,23.81 270 top
Q3  15.24,19.68 180 top
R1  10.56,9.21 90 top
R2  10.56,4.52 270 top
R3  2.54,23.73 90 top
R4  35.24,17.46 0 top
R5  18.73,19.68 0 top
R6  4.52,23.81 90 top
R7  32.07,12.06 270 top
R8  36.43,3.89 180 top
R9  58.42,24.13 0 top
R10  40.88,8.73 270 top
R11  40.88,11.35 270 top
R12  40.88,13.97 270 top
R13  23.81,19.68 90 top
SW1  19.68,4.45 180 top
TVS1  13.02,7.62 90 top
U1  53.98,12.7 270 top
U3  29.53,6.03 0 top
U4  6.99,16.51 270 top
U5  20.95,12.7 0 top
U6  30.16,18.41 180 top

### Tracks (layer width: path | path; a pad name or v marks a point on that pad's centre or on a via)
3.3V  (via drill 0.35)  (2 unrouted)
  Top 0.254: R8.2 35.93,4.37 IC1.5 | R4.1 R4.2 | U1.2 59.7,23.68 C4.1 R9.2 | R3.8 R3.6 | Q2.5 Q2.2 6.13,24.01 5.91,24.01 4.84,25.08 1.91,25.08 1.72,24.89 R3.8 | R5.7 R5.8 17.65,22.17 16.08,22.17 15.44,21.52 15.44,20.78 Q3.2 Q3.5 15.24,18.55 v14.61,17.92 | U6.1 32.44,21.22 v34.61,19.05 | R3.8 1.37,23.97 v0.79,23.97 | Q1.5 39.05,17.94 v38.58,17.46 39.05,16.99 Q1.2
  Top 0.305: C1.1 8.89,10.09 U4.17
  Top 0.406: v34.61,19.05 34.66,19 R4.1
  Top 0.508: 36.78,5.26 C2.1 33.95,5.92 33.94,5.92 33.83,6.03 U3.4 U3.2 24.87,6.03 24.79,6.11 23.26,6.11 23.02,5.88 21.3,5.88 v19.22,3.8 | 40.64,17.14 40.64,16.25 39.78,15.4 39.53,15.4 38.88,14.75 38.06,14.75 37.48,14.17 37.48,9.96 38.1,9.34 38.1,6.96 37.58,6.43 37.15,6.43 36.8,6.09 IC1.5 | 40.64,17.14 40.32,17.46 v38.58,17.46 | 40.64,17.14 40.64,19.73 C5.1 41.12,20.64 42.42,19.33 58.7,19.33 59.7,20.34 U1.2 | v8.89,13.65 U4.17
  Bottom 0.254: v0.79,23.97 0.79,19.45 0.67,19.32 0.67,18.78 1.34,18.1 4.09,18.1 4.25,18.26 7.23,18.26 7.55,17.94 8.1,17.94 8.32,18.16 10.79,18.16 | v14.61,17.92 14.36,18.16 11.43,18.16 | 10.79,18.16 11.11,18.16 | 11.11,18.16 11.43,18.16 | 11.11,18.16 11.11,17.78 | 11.11,17.78 10.79,18.1 10.79,18.16 | 11.11,17.78 11.43,18.1 11.43,18.16
  Bottom 0.406: v38.58,17.46 37.88,18.16 37.88,18.7 37.45,19.13 36.84,19.13 36.77,19.05 v34.61,19.05
  Bottom 0.508: v19.22,3.8 18.1,2.68 J6.4 15.1,4.27 11.11,4.27 9.84,5.54 9.84,9.7 10.36,10.21 10.36,12.19 v8.89,13.65 11.11,15.88 11.11,17.78
5V  (via drill 0.35)
  Top 0.254: C8.1 18.72,7.87 18.72,7.88 18.72,8.46 U5.14 18.72,8.56 18.72,9.14 21.01,11.43 | 21.01,11.43 21.41,11.43 | 21.41,11.43 U5.28 26.1,11.43 26.4,11.73 26.85,11.73 27.19,12.06 27.19,12.51 27.77,13.09 C7.1 28.16,13.72 28.16,13.78 28.65,14.27 29,14.27 29.43,14.7 33.39,14.7 33.97,15.28 33.97,16.51 34.1,16.64 R4.4 R4.3 | 21.21,11.63 21.01,11.43 | 21.41,11.43 21.21,11.63 | R3.5 4.37,23.3 R6.1 4.95,23.3 v5.4,22.86 | R13.2 23.37,19.75 23.36,19.75 22.82,19.2 C10.1 C9.1 21.21,19.14 U5.42 21.21,14.65 21.93,13.93 21.93,13.38 21.21,12.66 21.21,11.63 | R5.5 R5.6 19.32,19.45 20.24,19.45 20.48,19.21 20.49,19.2
  Top 0.406: C9.1 20.49,19.2 | v20.48,20.88 20.48,19.21
  Top 0.508: F1.2 15.37,5.84 16.19,6.67 C8.1 18.41,6.36 18.41,3.49 18.89,3.01 22.76,3.01 23.42,3.67 C3.1 26.28,3.67 U3.3 26.66,4.05 v34.97,4.05
  Bottom 0.254: v5.4,22.86 6.53,22.86 9,20.39 15.8,20.39 16.26,20.85 16.62,20.85 16.65,20.88 v20.48,20.88
  Bottom 0.508: v34.97,4.05 38.54,7.62 54.61,7.62 58.74,3.49 J4.6
BLU
  Top 0.254: D1.6 40.58,13.77 R12.2
CC1  (via drill 0.35)
  Top 0.254: R1.1 10.11,9.14 9.91,9.35 9.91,10.1 9.57,10.43 v9.57,10.54 | v8.89,7.02 8.52,6.65 J5.A5
  Bottom 0.254: v9.57,10.54 8.89,9.85 v8.89,7.02
CC2
  Top 0.254: J5.B5 10.19,3.65 R2.2
D_N  (via drill 0.35)
  Top 0.254: J5.A7 6.4,5.15 | 6.4,5.15 6.33,5.22 6.22,5.22 4.65,6.79 4.65,11.47 U4.14 | v6.33,6.65 6.61,6.37 6.78,6.19 6.79,6.19 6.83,6.15 J5.B7 8.63,6.15 8.78,6.29 9.1,6.29 9.61,6.81 10.79,6.81 11.28,7.29 12.74,7.29 12.76,7.3 13.65,7.3 13.97,6.99 TVS1.3 | v6.35,4.45 6.35,5.1 6.4,5.15
  Bottom 0.254: v6.33,6.65 6.33,4.46 v6.35,4.45
D_P  (via drill 0.35)
  Top 0.254: U4.15 6.35,11.05 5.08,9.78 5.08,6.97 6.4,5.65 J5.A6 9.04,5.65 v9.05,5.64 9.79,6.37 TVS1.1 | J5.B6 8.77,4.65 v9.05,4.37
  Bottom 0.254: v9.05,5.64 v9.05,4.37
ESP_ACK
  Top 0.254: Q1.4 39.8,18.93 39.69,19.05 38.42,19.05 | R4.8 36.59,19.05 37.78,19.05 | 38.42,19.05 37.78,19.05 | U1.9 50.81,20.65 50.05,19.89 42.66,19.89 40.96,21.59 38.76,21.59 38.52,21.36 38.52,19.79 38.1,19.37 | 38.1,19.37 37.78,19.05 | 38.42,19.05 38.1,19.37
ESP_BLUE  (via drill 0.35)
  Top 0.254: v41.01,15.51 41.01,14.61 R12.1 | U1.12 47.01,21.5 v47.96,20.55
  Bottom 0.254: v41.01,15.51 41.01,13.23 41.3,12.94 41.3,12.62 43.01,10.91 45.54,10.91 48.92,14.29 48.92,19.59 v47.96,20.55
ESP_CS  (via drill 0.35)
  Top 0.254: U6.4 30.68,21.14 30.68,20.71 v32,19.39 | v38.1,5.79 38.65,5.24 IC1.1 39.84,5.24 40.38,4.7 42.03,4.7 42.85,3.88 43.22,3.88 43.84,4.5 49.15,4.5 49.55,4.11 U1.29 | v36.36,8.58 36.05,8.89 36.05,14.69 v35,15.74
  Bottom 0.254: v35,15.74 32,18.75 v32,19.39 | v38.1,5.79 37.65,5.79 35.24,3.39 34.7,3.39 34.31,3.78 34.31,4.32 34.7,4.71 34.84,4.71 36.36,6.23 v36.36,8.58
ESP_EN  (via drill 0.35)  (1 unrouted)
  Top 0.254: C6.2 41.44,1.75 J6.13 | R9.1 58.35,23.69 58.35,23.68 58.44,23.6 U1.3 58.44,20.18 v58.38,20.12 | v57.22,7.05 56.52,6.35 44.4,6.35 43.06,5.01 v43.06,4.68
  Bottom 0.254: v58.38,20.12 58.38,8.21 v57.22,7.05 | v43.06,4.68 40.96,2.58 J6.13
ESP_GREEN  (via drill 0.35)
  Top 0.254: v40.64,10.04 40.88,9.81 R10.1 | U1.10 49.55,20.78 v49.78,20.55
  Bottom 0.254: v40.64,10.04 45.92,10.04 49.78,13.9 v49.78,20.55
ESP_IO0  (via drill 0.35)  (1 unrouted)
  Top 0.254: J6.14 43.5,2.48 U1.25 42.67,3.45 41.85,4.27 40.18,4.27 39.79,4.66 37.56,4.66 37.08,4.18 37.08,4.03 R8.1 | Q2.4 7.43,22.37 7.24,22.37 6.96,22.09 6.96,20.08 6.56,19.68 5.54,19.68 4.91,19.05 4.91,17.93 v5.24,17.6
ESP_MISO
  Top 0.254: IC1.2 41.82,6.19 41.85,6.17 43.6,6.17 46.64,9.21 58.1,9.21 59.7,7.61 U1.37
ESP_MOSI  (via drill 0.35)
  Top 0.254: U1.13 45.27,21.48 45.27,21.07 44.52,20.32 42.84,20.32 41.14,22.02 35.99,22.02 v34.28,20.31 | U6.6 29,21.14 29,20.58 28.71,20.3 28.71,18.71 29.01,18.41 32.07,18.41 v33.02,19.37
  Bottom 0.254: v34.28,20.31 33.34,19.37 v33.02,19.37
ESP_RED  (via drill 0.35)
  Top 0.254: v40.64,12.66 40.88,12.43 R11.1 | U1.11 48.27,21.16 v48.89,20.55
  Bottom 0.254: v40.64,12.66 42.83,10.48 45.72,10.48 49.35,14.11 49.35,20.05 49.12,20.28 49.12,20.31 v48.89,20.55
ESP_RX  (via drill 0.35)
  Top 0.254: U1.34 55.9,4.78 58.42,7.3 58.42,8.14 57.78,8.78 55.95,8.78 v55.72,8.55 | v47.77,10.96 47.1,11.63 47.1,15.1 45.99,16.21 45.45,16.21 45.06,15.83 45.06,14.73 v44.94,14.61 | v31.75,16.51 31.75,15.54 U6.15
  Bottom 0.254: v55.72,8.55 55.4,8.55 55.34,8.61 48.86,8.61 47.62,9.84 47.62,10.82 v47.77,10.96 | v44.94,14.61 44.94,13.36 44.65,13.07 43.9,13.07 43.5,13.47 43.5,16.39 41.99,17.89 39.99,17.89 38.59,16.5 38.59,14.15 37.99,13.55 32.38,13.55 31.75,14.18 v31.75,16.51
ESP_RX_5V  (2 unrouted)
  Bottom 0.254: J4.4 49.39,5.54 46.99,5.54 41.59,5.54 40.27,5.54 40.22,5.5 40.12,5.4
ESP_SCK  (via drill 0.35)
  Top 0.254: U6.12 v29.84,16.5 v29.84,16.51 | v30.09,14.04 30.09,13.9 29.68,13.48 29.68,12.4 30.09,11.99 31.02,11.99 31.29,11.73 31.29,10.65 30.8,10.16 30.16,10.16 29.53,9.53 29.53,8.67 v30.2,8 | v50.8,5.08 50.81,5.07 U1.30
  Bottom 0.254: v29.84,16.51 29.84,14.29 v30.09,14.04 | v50.8,5.08 49.91,5.97 39.95,5.97 39.69,5.71 39.69,4.4 39.74,4.35 39.74,3.45 39.11,2.81 37.91,2.81 37.23,3.49 35.95,3.49 35.42,2.96 34.52,2.96 33.88,3.6 33.88,4.5 34.52,5.14 34.66,5.14 35.24,5.72 35.24,7.17 34.74,7.67 34.74,7.98 34.51,8.22 30.43,8.22 v30.2,8
ESP_SCL  (via drill 0.35)
  Top 0.254: v57.48,2.17 57.7,2.4 57.79,2.4 58.44,3.04 U1.36 | v38.66,3.9 38.66,1.51 J6.12
  Bottom 0.254: v57.48,2.17 57.47,2.18 57.47,3.97 54.38,7.06 39.58,7.06 38.83,6.31 38.83,4.07 v38.66,3.9
ESP_SDA  (via drill 0.35)
  Top 0.254: U1.33 54.16,3.92 54.16,4.33 53.03,5.45 v53.01,5.45 | v37.74,3.91 37.74,3.13 J6.11
  Bottom 0.254: v53.01,5.45 52.06,6.4 39.63,6.4 39.26,6.03 39.26,4.22 39.31,4.17 39.31,3.63 38.93,3.24 38.38,3.24 38,3.63 38,3.65 v37.74,3.91
ESP_TX  (via drill 0.35)
  Top 0.254: Q1.1 37.15,17.71 R4.7 | Q1.1 38.2,16.56 | Q1.1 38.26,16.52 v37.37,16.52 | U1.35 57.16,4.78 v57.86,5.48 | v37,9.21 36.48,9.72 36.48,14.97 v36.76,15.25
  Bottom 0.254: v37,9.21 38.03,8.18 55.16,8.18 v57.86,5.48 | v36.76,15.25 36.76,15.91 v37.37,16.52
ESP_TX_5V  (via drill 0.35)  (2 unrouted)
  Top 0.254: Q1.6 37.18,18.36 v37.15,18.39 | R4.5 35.82,15.87 v35.98,15.72
  Bottom 0.254: v37.15,18.39 35.98,17.22 v35.98,15.72
GND  (via drill 0.35)  (17 unrouted)
  Top 0.254: U5.15 19.18,7.81 19.37,7.62 | U5.29 24.42,11.94 24.37,11.99 | U5.43 20.7,16.1 20.64,16.03
  Top 0.305: C1.2 9.21,8.65 J5.A1B12 7.7,8.65 8.26,9.21
  other vias: 60.33,12.06
  pour Top (isolate 0.254): 0,25.4 62.23,25.4 62.23,0 0,0
  pour Bottom (isolate 0.254): 0,25.4 62.23,25.4 62.23,0 0,0
GRN
  Top 0.254: R10.2 40.04,8.22 38.91,9.35 D1.4
IO0_5V  (1 unrouted)
  Top 0.254: Q2.3 6.08,23.31 5.91,23.31 4.9,24.32 R6.2
N$2
  Top 0.254: D2.C 31.7,12.94 R7.1
N$4  (1 unrouted)
PA0_D2  (via drill 0.35)
  Top 0.254: v18.8,15.18 19.27,15.65 19.64,15.65 20.19,16.2 U5.44
  Bottom 0.254: v18.8,15.18 18.8,15.07 18.41,14.68 18.41,12.5 19.37,11.54 23.6,11.54 26.89,14.84 27.75,14.84 29.91,12.68 38.45,12.68 39.46,13.69 39.46,16.14 40.34,17.03 41.63,17.03 42.64,16.03 42.64,13.11 43.54,12.2 45.01,12.2 47.62,14.82 47.62,18.73 46.44,19.92 46.44,21.18 47.33,22.07 49.06,22.07 J9.3
PA1_D7  (via drill 0.35)  (1 unrouted)
  Top 0.254: U5.45 19.63,16.84 19.63,16.26 19.46,16.08 18.73,16.08 17.92,15.27 v17.92,15.18
PA2_D20_SDA
  Top 0.254: J9.17 14.92,24.13 13.77,22.97 13.77,17.78 14.29,17.26 15.81,17.26 16.9,18.35 17.59,18.35 18.8,18.35 19.18,17.97 U5.46
PA3_D21_SCL
  Top 0.254: J9.18 13.34,23.81 13.34,17.46 13.97,16.83 15.99,16.83 17.08,17.92 17.41,17.92 18.23,17.92 18.67,17.47 U5.47 18.62,16.94
PA4_D24_TX2  (1 unrouted)
PA5_D23_RX2  (1 unrouted)
PA6_D28  (1 unrouted)
PA7_D29  (via drill 0.35)
  Top 0.254: v27.26,22.2 27.33,22.13 30.77,22.13 30.95,21.95 30.95,21.53 U6.3 | v20.55,14.53 16.81,14.53 U5.3
  Bottom 0.254: 20.68,14.53 v20.55,14.53 22.86,14.53 22.86,14.54 23.48,15.16 23.48,16.07 23.14,16.41 23.14,17.51 23.42,17.79 23.42,21.11 24.5,22.2 v27.26,22.2
PB0_D9~  (via drill 0.35)
  Top 0.254: U5.4 20.18,13.97 20.28,13.87 21.06,13.87 v21.27,13.65
  Bottom 0.254: J9.10 32.56,24.13 31.31,22.89 31.14,22.89 30.36,22.1 30.36,20.57 30.46,20.48 30.46,19.57 28.75,17.87 25.98,17.87 25.58,17.46 25.58,15.74 24.47,14.63 24.47,13.7 24.09,13.31 23.54,13.31 23.2,13.65 v21.27,13.65
PB1_D10~  (via drill 0.35)
  Top 0.254: J9.11 30.34,24.13 v29,22.79 | U5.5 19.48,13.46 v19.68,13.26
  Bottom 0.254: v19.68,13.26 19.89,13.46 19.89,14.8 20.28,15.18 20.82,15.18 21.05,14.96 22.66,14.96 23.05,15.34 23.05,15.89 22.7,16.23 22.7,17.69 22.99,17.97 22.99,21.4 24.45,22.86 27.53,22.86 27.6,22.79 v29,22.79
PB2_D5~  (via drill 0.35)
  Top 0.254: v45.72,15.56 46.06,15.22 46.1,15.22 46.67,14.64 v46.67,9.87 | U5.6 16.71,12.9 16.13,12.9 15.82,12.6 v15.56,12.6 | v28.83,8.63 26.99,6.79 26.99,6.76 25.4,6.76 25.32,6.67 23.02,6.67 22.81,6.45 21.08,6.45 19.52,4.89 v19.2,4.89
  Bottom 0.254: J9.6 43.5,22.86 45.14,21.22 45.14,19.38 46.07,18.45 46.07,15.91 v45.72,15.56 | v46.67,9.87 46.06,9.25 46.06,9.12 45.67,8.73 45.13,8.73 44.9,8.96 40.19,8.96 38.19,10.96 31.15,10.96 v28.83,8.63 | v15.56,12.6 15.56,9.8 15.42,9.66 15.42,8.67 v19.2,4.89
PB4_D27_TX0  (via drill 0.35)
  Top 0.254: R3.4 4.15,22.37 4.19,22.37 4.47,22.09 4.47,18.48 4.45,18.45 4.45,17.46 4.97,16.94 7.1,16.94 9.53,19.37 9.53,20.05 9.49,20.08 9.49,22.27 v9.82,22.6 | v14.71,22.12 14.71,20.98 14.49,20.75 Q3.3 | U5.8 15.03,11.94 13.32,13.64 13.32,16.27 13.34,16.28 13.34,16.85 12.1,18.09 12.1,22.57 v12.06,22.6
  Bottom 0.254: v9.82,22.6 v12.06,22.6 14.23,22.6 v14.71,22.12
PB5_D26_RX0  (via drill 0.35)
  Top 0.254: R5.4 18.08,18.79 Q3.6 15.99,18.37 v15.54,17.92 | v12.68,16.55 12.7,16.53 12.7,13.65 14.92,11.43 U5.9
  Bottom 0.254: v15.54,17.92 14.88,17.26 13.38,17.26 v12.68,16.55
PC0_MOSI  (via drill 0.35)
  Top 0.254: v20.59,12.98 18.54,10.92 U5.10 | v24.49,16.19 24.49,15.93 23.16,14.59 23.16,13.61 v22.5,12.96 | U6.7 28.34,21.14 28.34,20.71 27.94,20.31 v27.94,19.39
  Bottom 0.254: v27.94,19.39 25.03,19.39 24.64,19 24.64,16.35 v24.49,16.19 | v20.59,12.98 20.61,12.96 v22.5,12.96
PC1_MISO  (via drill 0.35)
  Top 0.254: U5.11 16.82,10.36 17.4,10.36 17.58,10.19 17.58,7.94 v18.07,7.45 | IC1.4 36.2,7.14 v35.4,7.94
  Bottom 0.254: v18.07,7.45 19.5,8.89 21.27,8.89 21.32,8.93 22.23,8.93 22.46,9.16 24.27,9.16 25.52,10.41 26.62,10.41 27.01,10.03 27.01,9.53 28.6,7.94 29.21,7.94 29.93,8.65 34.68,8.65 v35.4,7.94
PC2_SCK  (via drill 0.35)
  Top 0.254: v27.48,14.18 27.87,14.18 28.39,14.7 28.82,14.7 29,14.88 29,15.3 U6.11 | U5.12 16.76,9.46 v16.51,9.21
  Bottom 0.254: v16.51,9.21 18.41,11.11 23.78,11.11 26.84,14.18 v27.48,14.18
PC4_D1_TX1  (via drill 0.35)
  Top 0.254: U5.16 19.74,8.56 19.74,9.35 20.57,10.19 20.69,10.19 v20.96,10.46
  Bottom 0.254: v20.96,10.46 21.19,10.68 23.96,10.68 25.53,12.25 38.63,12.25 39.89,13.51 39.89,15.97 40.52,16.6 41.46,16.6 42.2,15.85 42.2,12.93 43.36,11.77 45.18,11.77 48.05,14.64 48.05,18.91 46.87,20.1 46.87,21 47.51,21.64 53.07,21.64 53.66,22.23 J9.2
PC5_D0_RX1  (via drill 0.35)
  Top 0.254: v21.78,10.02 21.71,10.02 21.44,9.75 20.75,9.75 20.24,9.25 20.24,8.56 U5.17
  Bottom 0.254: v21.78,10.02 23.91,10.02 25.71,11.82 38.81,11.82 40.32,13.34 40.32,15.79 40.7,16.17 41.28,16.17 41.77,15.67 41.77,12.75 43.19,11.34 45.36,11.34 48.48,14.46 48.48,19.09 47.3,20.28 47.3,20.82 47.69,21.21 53.27,21.21 J9.1
PC6_D4  (via drill 0.35)
  Top 0.254: v45.82,14.56 45.4,14.14 v45.4,9.39 | v28.58,9.52 27.04,9.52 26.62,9.1 26.08,9.1 25.85,9.32 24.64,9.32 24.33,9.63 24.33,9.96 24.13,10.16 22.85,10.16 22.01,9.32 20.93,9.32 20.75,9.14 20.75,8.56 U5.18
  Bottom 0.254: J9.5 46.04,22 45.57,21.54 45.57,19.56 46.76,18.38 46.76,15.5 v45.82,14.56 | v45.4,9.39 40.37,9.39 38.37,11.39 30.45,11.39 v28.58,9.52
PD0_A0  (via drill 0.35)
  Top 0.254: v21.03,7.14 21.26,7.37 21.26,7.43 21.72,7.88 U5.20
  Bottom 0.254: v21.03,7.14 21.03,6.59 21.8,5.82 21.8,2.12 20.95,1.27 J6.5
PD1_A1  (via drill 0.35)
  Top 0.254: v21.92,7.15 22.12,7.36 22.12,7.65 22.23,7.76 U5.21
  Bottom 0.254: J6.6 22.23,2.21 22.23,6.84 v21.92,7.15
PD2_A2  (via drill 0.35)
  Top 0.254: U5.22 22.73,7.43 v22.78,7.38
  Bottom 0.254: v22.78,7.38 22.78,7.06 22.89,6.95 22.89,6.38 22.67,6.16 22.67,3.17 23.33,2.52 23.69,2.52 24.94,1.27 J6.7
PD3_A3  (via drill 0.35)
  Top 0.254: U5.23 23.29,8.46 23.29,7.88 23.66,7.5 v23.66,7.38
  Bottom 0.254: v23.66,7.38 23.66,6.54 23.1,5.98 23.1,3.49 23.64,2.95 25.8,2.95 27.48,1.27 J6.8
PD4_A4  (via drill 0.35)
  Top 0.254: U5.24 24.55,7.71 v24.55,7.38
  Bottom 0.254: v24.55,7.38 24.32,7.16 24.32,6.59 23.53,5.8 23.53,3.67 23.82,3.38 25.98,3.38 26.84,2.52 28.77,2.52 30.02,1.27 J6.9
PD5_A5  (via drill 0.35)
  Top 0.254: U5.25 25.3,9.76 v26.35,9.76
  Bottom 0.254: v26.35,9.76 25.2,8.61 25.2,6.86 23.96,5.62 23.96,3.98 24.13,3.81 26.16,3.81 27.02,2.95 30.88,2.95 32.56,1.27 J6.10
PD6_A6
  Top 0.254: U5.26 26.81,10.41 27.05,10.18 29.47,10.18 D2.A
PD7_A7_AREF  (via drill 0.35)
  Top 0.254: C11.1 C12.1 27.5,11.07 v26.67,11.07 26.52,10.92 U5.27
  Bottom 0.254: v26.67,11.07 25.57,11.07 24.09,9.59 22.28,9.59 22.05,9.37 21.11,9.37 19.8,10.68 18.91,10.68 16.78,8.55 16.24,8.55 15.85,8.94 15.85,9.48 16.24,9.87 16.56,9.87 17.26,10.57 17.26,18.18 18.1,19.02 20.61,19.02 21.21,18.41 21.21,18.14 21.59,17.76 22.14,17.76 22.55,18.17 22.55,19.73 20.75,21.53 20.21,21.53 19.98,21.31 19.02,21.31 18.1,22.23 J9.16
PE0_D11
  Top 0.254: J9.12 25.55,21.43 25.55,20.68 26.82,19.41 26.82,13.33 25.99,12.5 25.2,12.5 U5.30
PE1_D12
  Top 0.254: U5.31 25.2,13.01 25.88,13.01 26.39,13.51 26.39,19.23 25.12,20.5 25.12,23.53 J9.13
PE2_D13
  Top 0.254: U5.32 25.2,13.51 25.78,13.51 25.96,13.69 25.96,19.05 24.69,20.32 24.69,22.62 J9.14
PE3_D8  (via drill 0.35)
  Top 0.254: v31.98,22.63 30.09,22.63 v29.93,22.79 | v23.81,13.97 U5.33
  Bottom 0.254: J9.9 35.1,24.13 33.85,22.89 32.24,22.89 v31.98,22.63 | v23.81,13.97 23.81,14.59 25.15,15.92 25.15,17.64 25.81,18.3 28.57,18.3 30.03,19.75 30.03,20.3 29.93,20.4 v29.93,22.79
PF2_D35_A12  (via drill 0.35)
  Top 0.254: v29.37,20.02 29.84,20.49 U6.5 | U5.36 25.21,15.56 25.21,18.64 v25.3,18.73
  Bottom 0.254: v29.37,20.02 28.6,19.25 28.6,19.12 28.21,18.73 v25.3,18.73
PF3_D36_A13  (1 unrouted)
  Top 0.254: R4.6 35.89,17.15 36.38,17.15 36.56,16.97 36.56,16.38 37.08,15.86 37.65,15.86 37.74,15.96 39.37,15.96 39.56,16.15 39.56,16.32 Q1.3
PF4_D6~  (1 unrouted)
PF5_D3~  (via drill 0.35)
  Top 0.254: U5.39 22.73,15.96 v22.39,15.62
  Bottom 0.254: 19.3,12.32 19.64,11.98 23.42,11.98 26.71,15.27 27.93,15.27 30.09,13.12 38.17,13.12 39.03,13.97 39.03,16.32 40.17,17.46 41.81,17.46 43.07,16.21 43.07,13.29 43.72,12.64 44.83,12.64 47.19,15 47.19,18.55 46,19.74 46,21.36 47.15,22.5 47.62,22.5 48.58,23.45 J9.4 | 19.24,12.38 19.3,12.32 | 19.3,12.32 19.3,12.71 19.03,12.98 19.03,13.53 19.46,13.96 19.46,14.98 20.1,15.62 v22.39,15.62
PF6_RST  (1 unrouted)
  Top 0.254: J6.3 17.29,3 SW1.2 | U5.40 22.23,17.84 22.52,18.14 22.52,18.41 22.73,18.62 22.98,18.62 23.55,19.18 R13.1
RED
  Top 0.254: R11.2 40.44,11.29 40.43,11.29 39.65,12.06 D1.5
RESETN
  Top 0.254: J9.19 10.48,22.43 10.77,22.15 10.77,19.97 7.3,16.51 3.81,16.51 1.91,18.41 | R3.2 2.23,23.09 2.23,22.59 1.91,22.27 1.91,19.4 1.98,19.32 1.98,18.78 1.91,18.7 1.91,18.41 | 1.91,18.41 1.91,16.17 3.15,14.93 3.15,10.87 2.92,10.65 2.16,10.65 1.94,10.87 1.94,11.24 U4.11
RX_D11  (via drill 0.35)
  Top 0.254: R3.3 2.79,22.5 3.15,22.15 3.15,20.08 3.09,20.03 v3.09,19.71 | v1.32,19.05 1.27,19.1 U4.10 | Q3.4 14.49,19.62 v14.42,19.68
  Bottom 0.254: v1.32,19.05 1.98,19.71 v3.09,19.71 3.11,19.68 v14.42,19.68
SWCLK  (via drill 0.35)
  Top 0.254: R3.1 0.93,22.37 0.89,22.37 0.67,22.15 0.67,16.8 2.54,14.92 U4.12 1.88,12.57 1.88,12.94 1.65,13.16 0.89,13.16 0.64,12.91 0.64,8.57 v5.08,4.13
  Bottom 0.254: v5.08,4.13 5.74,4.13 6.16,3.71 12.17,3.71 13.02,2.86 J6.2
SWDIO  (via drill 0.35)
  Top 0.254: v3.99,7.3 3.99,11.72 U4.13
  Bottom 0.254: J6.1 8.47,3.28 5,3.28 3.99,4.29 v3.99,7.3
TX_D11  (via drill 0.35)
  Top 0.254: U4.9 2.54,20.09 2.43,19.98 2.43,19.43 2.82,19.05 3.52,19.05 v3.82,18.75 | v15.9,19.68 15.99,19.78 Q3.1 16.04,20.64 16.95,20.64 17.59,20 18.09,20 R5.2
  Bottom 0.254: v3.82,18.75 4.32,19.25 13.93,19.25 14.15,19.03 15.24,19.03 v15.9,19.68
UPDI_3V3  (via drill 0.35)
  Top 0.254: U4.7 U4.6 6.35,22.23 6.63,22.51 6.74,22.51 6.93,22.7 6.93,22.8 v7.22,23.1 | Q2.1 7.13,24.56 v7.22,24.47 | R5.1 17.15,21.51 v16.35,21.51
  Bottom 0.254: v7.22,24.47 v7.22,23.1 7.22,22.78 9.18,20.82 15.62,20.82 16.08,21.29 16.12,21.29 v16.35,21.51
UPDI_5V  (via drill 0.35)
  Top 0.254: Q2.6 8.37,24.32 8.54,24.32 8.73,24.13 8.73,22.7 8.22,22.2 8.22,19 v7.82,18.6 | v17.07,19.45 18.14,19.45 R5.3 | U5.41 21.72,18.27 v21.87,18.41
  Bottom 0.254: v7.82,18.6 15.74,18.6 16.59,19.45 v17.07,19.45 20.84,19.45 v21.87,18.41
V_USB
  Top 0.406: F1.1 14.03,5.43 14.42,5.43 14.7,5.71 14.73,5.71 14.73,7 13.81,7.93 13.52,7.93 13.29,8.15 13.29,8.59 TVS1.5
  Top 0.508: J5.B4A9 11.55,2.95 F1.1 | TVS1.5 12.79,8.64 12.79,8.13 12.51,7.85 J5.A4B9